# Altium schematic sheet Sheet1.SchDoc
size A4; PageSetup: Record=PageOptions|CenterHorizontal=True|CenterVertical=True|PrintScale=1.00|XCorrection=1.00|YCorrection=1.00|PrintKind=0|BorderSize=5000000|LeftOffset=0|BottomOffset=0|Orientation=2|PaperLength=1000|PaperWidth=1000|Scale=100|PaperSource=7|PrintQuality=-3|MediaType=1|DitherType=10|PrintScaleMode=1|PaperKind=A4|PaperIndex=9
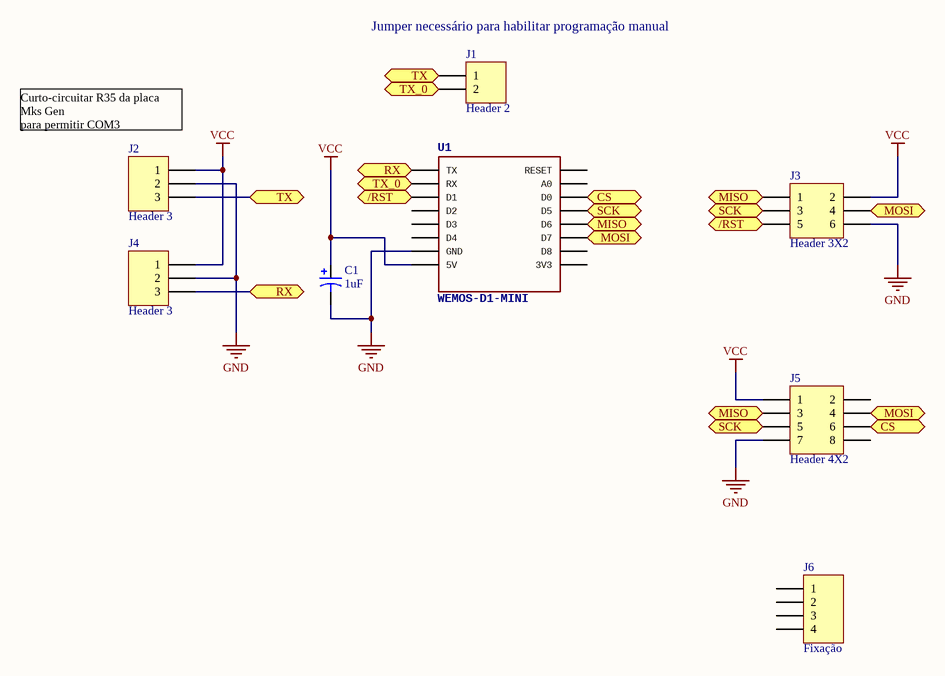
[diagram p0: Sheet1.SchDoc]

## Parts
C1  value 1uF  [CAPR5-4X5]  (hidden comment: Cap Pol1)
J1  Header 2  [HDR1X2]
J2  Header 3  [HDR1X3]
J3  Header 3X2  [HDR2X3]
J4  Header 3  [HDR1X3]
J5  Header 4X2  [HDR2X4]
J6  Fixação  [HDR1X4]
U1  WEMOS-D1-MINI  [WEMOS-D1-MINI]

## Ports
/RST, CS, MISO, MOSI, RX, SCK, TX, TX_0

## Nets
GND: C1.2 J2.2 J3.6 J4.2 J5.7 U1.GND
VCC: C1.1 J2.1 J3.2 J4.1 J5.1 U1.5V
/RST: J3.5 U1.D1 ; port /RST
CS: J5.6 U1.D0 ; port CS
MISO: J3.1 J5.3 U1.D6 ; port MISO
MOSI: J3.4 J5.4 U1.D7 ; port MOSI
RX: J4.3 U1.TX ; port RX
SCK: J3.3 J5.5 U1.D5 ; port SCK
TX: J1.1 J2.3 ; port TX
TX_0: J1.2 U1.RX ; port TX_0

Not connected (* = marked no-connect by the designer): J5 2 8; J6 1 2 3 4; U1 3V3 A0 D2 D3 D4 D8 RESET

## Notes on the sheet
- (near J1) Jumper necessário para habilitar programação manual
- (near J2) Curto-circuitar R35 da placa Mks Gen
  para permitir COM3

## Library data of the parts
C1 = Cap Pol1: Polarized Capacitor (Radial); Published: 8-Jun-2000; LatestRevisionDate: 17-Jul-2002; LatestRevisionNote: Re-released for DXP Platform.; PackageReference: RB7.6-15; Publisher: Altium Limited; PackageDescription: Polarized Capacitor (Radial); 2 Leads
J1 = Header 2: Header, 2-Pin; LatestRevisionDate: 17-Jul-2002; LatestRevisionNote: Re-released for DXP Platform.; Publisher: Altium Limited
J2 J4 = Header 3: Header, 3-Pin; LatestRevisionDate: 17-Jul-2002; LatestRevisionNote: Re-released for DXP Platform.; Publisher: Altium Limited
J3 = Header 3X2: Header, 3-Pin, Dual row; LatestRevisionDate: 17-Jul-2002; LatestRevisionNote: Re-released for DXP Platform.; Publisher: Altium Limited
J5 = Header 4X2: Header, 4-Pin, Dual row; LatestRevisionDate: 17-Jul-2002; LatestRevisionNote: Re-released for DXP Platform.; Publisher: Altium Limited
J6 = Header 4: Header, 4-Pin; LatestRevisionDate: 17-Jul-2002; LatestRevisionNote: Re-released for DXP Platform.; Publisher: Altium Limited